# Altium schematic sheet 1_waffling80-MX_top.SchDoc: waffling60 - PCB
size A4; Engineer: 4pplet; Revision: RevA; ProjectName: waffling60
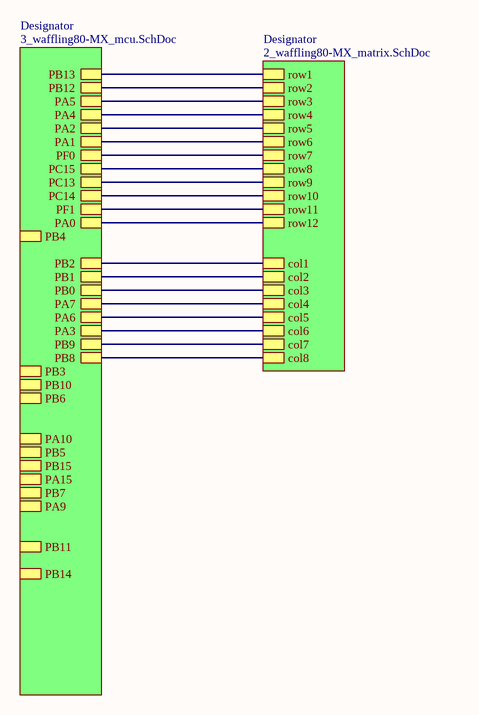
[diagram p0: 1_waffling80-MX_top.SchDoc]

## Sub-sheets
Designator = 3_waffling80-MX_mcu.SchDoc: PB6, PB5, PB0, PB7, PB3, PB2, PB1, PB4, PF1, PF0, PA7, PA6, PA5, PA4, PA3, PB15, PA15, PC13, PC14, PC15, PB8, PB11, PB12, PB13, PB9, PA10, PA0, PA1, PA2, PA9, PB10, PB14
Designator = 2_waffling80-MX_matrix.SchDoc: col6, col8, col5, col7, col3, col2, col1, col4, row3, row1, row4, row2, row6, row5, row8, row11, row10, row9, row12, row7

## Nets
(unnamed): sheet Designator/PB0, sheet Designator/col3
(unnamed): sheet Designator/PB2, sheet Designator/col1
(unnamed): sheet Designator/PB1, sheet Designator/col2
(unnamed): sheet Designator/PF1, sheet Designator/row11
(unnamed): sheet Designator/PF0, sheet Designator/row7
(unnamed): sheet Designator/PA7, sheet Designator/col4
(unnamed): sheet Designator/PA6, sheet Designator/col5
(unnamed): sheet Designator/PA5, sheet Designator/row3
(unnamed): sheet Designator/PA4, sheet Designator/row4
(unnamed): sheet Designator/PA3, sheet Designator/col6
(unnamed): sheet Designator/PC13, sheet Designator/row9
(unnamed): sheet Designator/PC14, sheet Designator/row10
(unnamed): sheet Designator/PC15, sheet Designator/row8
(unnamed): sheet Designator/PB8, sheet Designator/col8
(unnamed): sheet Designator/PB12, sheet Designator/row2
(unnamed): sheet Designator/PB13, sheet Designator/row1
(unnamed): sheet Designator/PB9, sheet Designator/col7
(unnamed): sheet Designator/PA0, sheet Designator/row12
(unnamed): sheet Designator/PA1, sheet Designator/row6
(unnamed): sheet Designator/PA2, sheet Designator/row5